# EAGLE schematic DiscoveryConnector_V1_1 (EAGLE 9.6.2)
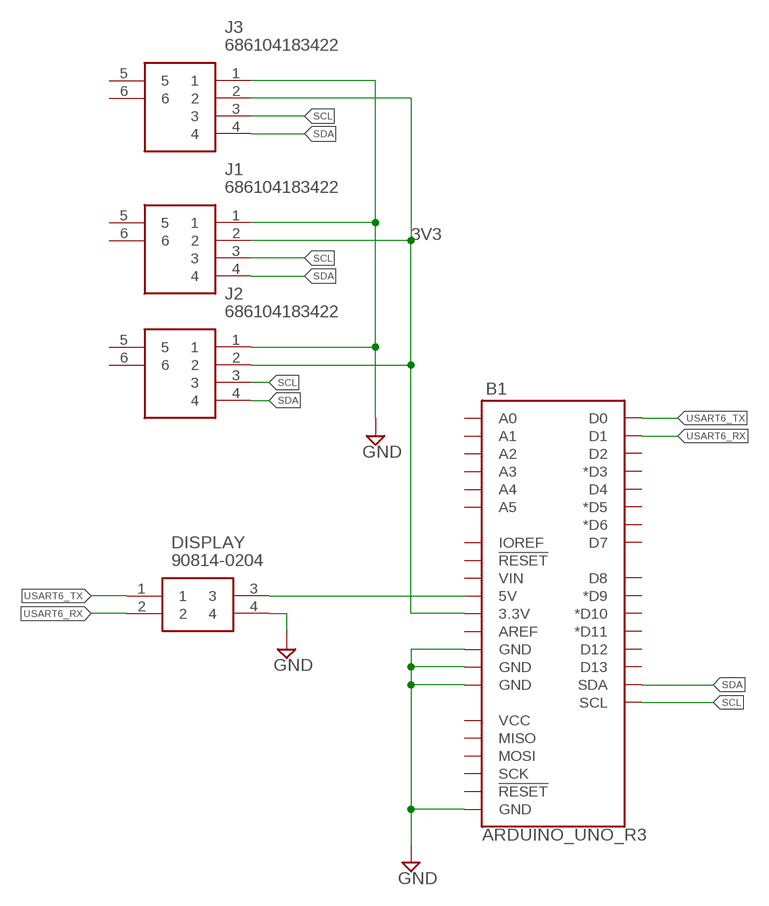
[diagram p0: schematic, sheet 1]

## Parts
B1  ARDUINO_UNO_R3  [ARDUINO_R3]
DISPLAY  90814-0204  [MOLEX_90814-0204]
J1  686104183422  [686104183422]
J2  686104183422  [686104183422]
J3  686104183422  [686104183422]

## Nets
3V3: B1.3.3V J1.2 J2.2 J3.2
GND: B1.GND@1(GND) B1.GND@2(GND) B1.GND@3(GND) B1.GND@4(GND) DISPLAY.4 J1.1 J2.1 J3.1
N$1: B1.5V DISPLAY.3
SCL: B1.SCL J1.3 J2.3 J3.3
SDA: B1.SDA J1.4 J2.4 J3.4
USART6_RX: B1.D1 DISPLAY.2
USART6_TX: B1.D0 DISPLAY.1
Unconnected: B1.A0 B1.A1 B1.A2 B1.A3 B1.A4 B1.A5 B1.AREF B1.D2 B1.D3(*D3) B1.D4 B1.D5(*D5) B1.D6(*D6) B1.D7 B1.D8 B1.D9(*D9) B1.D10(*D10) B1.D11(*D11) B1.D12 B1.D13 B1.IOREF B1.MISO B1.MOSI B1.RESET@1(!RESET!) B1.RESET@2(!RESET!) B1.SCK B1.VCC B1.VIN J1.5 J1.6 J2.5 J2.6 J3.5 J3.6

## Library data of the parts
B1 = electro_mechanical:ARDUINO_UNO_R3: Arduino R3 Footprint with SPI header Arduino Uno R3 Compatible Footprint. Matches PCB size of the original board. SparkFun Products: SAMD21 Dev Breakout <https://www.sparkfun.com/products/13672> RedBoard <https://www.sparkfun.com/products/12757> R3 Stackable Headers <https://www.sparkfun.com/products/11417>
DISPLAY = electro_mechanical:90814-0204: CONN HEADER 4POS 1.27MM SMD TIN Source: Datasheet <https://componentsearchengine.com/Datasheets/1/90814-0204.pdf>; DESCRIPTION: CONN HEADER 4POS 1.27MM SMD TIN; HEIGHT: mm; MANUFACTURER_NAME: Molex; MANUFACTURER_PART_NUMBER: 90814-0204; MOUSER_PART_NUMBER: 538-90814-0204; MOUSER_PRICE-STOCK: https://www.mouser.com/Search/Refine.aspx?Keyword=538-90814-0204
J1-J3 = electro_mechanical:686104183422: Wurth Elektronik WR-FPC Series 1mm Pitch 4 Way Horizontal SMT Female FPC Connector, Top Contact Source: Datasheet <https://componentsearchengine.com/Datasheets/1/686104183422.pdf>; DESCRIPTION: Wurth Elektronik WR-FPC Series 1mm Pitch 4 Way Horizontal SMT Female FPC Connector, Top Contact; HEIGHT: 1.3mm; MANUFACTURER_NAME: Wurth Elektronik; MANUFACTURER_PART_NUMBER: 686104183422; MOUSER_PART_NUMBER: 710-686104183422; MOUSER_PRICE-STOCK: https://www.mouser.com/Search/Refine.aspx?Keyword=710-686104183422